# Altium schematic sheet 04_FEATHER-CONNECTION.SchDoc
size A4; CheckedBy: Inženjer 2; CompanyName: Byte Lab Grupa d.o.o.; Engineer: Matija Puskar; Organization: Byte Lab Grupa d.o.o.; Address1: Medarska 69/1, 10000 Zagreb, Croatia; DocumentNumber: 1; SheetNumber: 4; SheetTotal: 7; Web: www.byte-lab.com; ProjectName: P1X-0XX
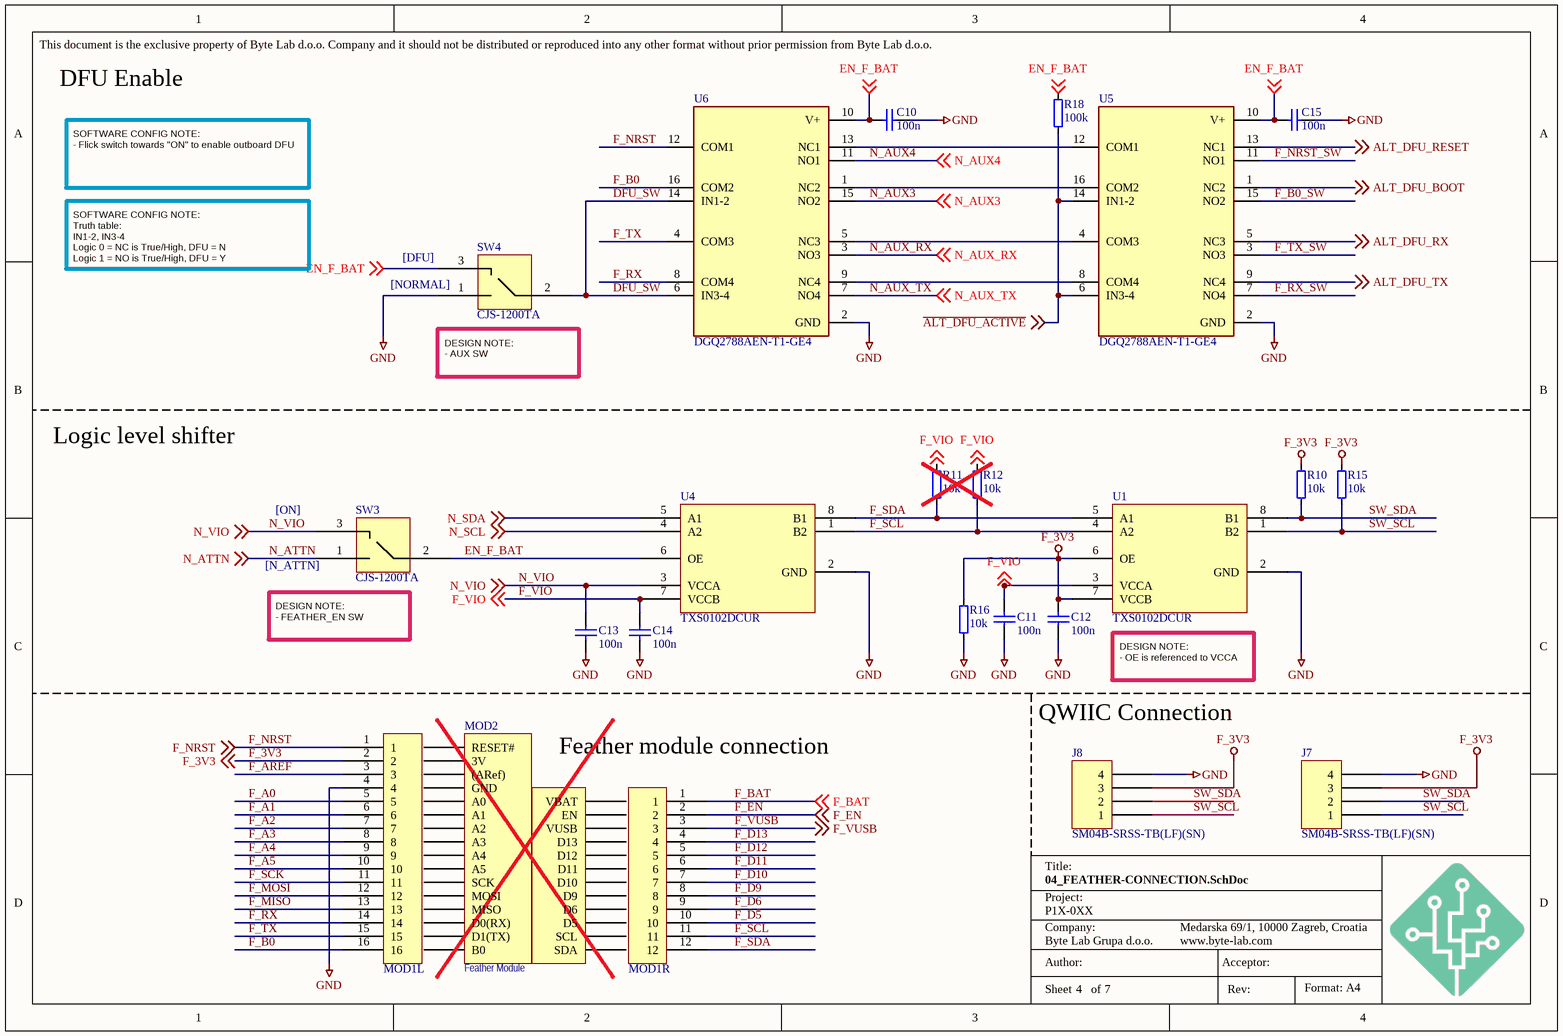
[diagram p0: 04_FEATHER-CONNECTION.SchDoc]

## Parts
C10  100n  [C-0402]
C11  100n  [C-0402]
C12  100n  [C-0402]
C13  100n  [C-0402]
C14  100n  [C-0402]
C15  100n  [C-0402]
J7  SM04B-SRSS-TB(LF)(SN)  [JST SM04B-SRSS-TB]
J8  SM04B-SRSS-TB(LF)(SN)  [JST SM04B-SRSS-TB]
MOD1L  CES-116-01-L-S  [16PIN_254MM]  (value not drawn)
MOD1R  CES-112-01-L-S  [12PIN_254MM]  (value not drawn)
MOD2  Feather Module  [BLUES_WIRELESS_SWAN_2-54_HEADERS]  (no BOM)
R10  10k  [R-0402]
R11  10k  [R-0402]
R12  10k  [R-0402]
R15  10k  [R-0402]
R16  10k  [R-0402]
R18  100k  [R-0402]
SW3  CJS-1200TA  [SW_CJS-1200TA]
SW4  CJS-1200TA  [SW_CJS-1200TA]
U1  TXS0102DCUR  [SOP50P310X90-8N]
U4  TXS0102DCUR  [SOP50P310X90-8N]
U5  DGQ2788AEN-T1-GE4  [QFN40P260X180X60-16N]
U6  DGQ2788AEN-T1-GE4  [QFN40P260X180X60-16N]

## Nets
F_3V3: C12.1 J7.3 J8.3 MOD1L.2 R10.2 R15.2 R16.1 U1.6(OE) U1.7(VCCB) ; off-sheet F_3V3
GND: C10.1 C11.2 C12.2 C13.2 C14.2 C15.1 J7.4 J8.4 MOD1L.4 R16.2 SW4.1 U1.2(GND) U4.2(GND) U5.2(GND) U6.2(GND)
~{ALT_DFU_ACTIVE}: R18.1 U5.6(IN3-4) U5.14(IN1-2) ; off-sheet ~{ALT_DFU_ACTIVE}
ALT_DFU_BOOT: U5.1(NC2) ; off-sheet ALT_DFU_BOOT
ALT_DFU_RESET: U5.13(NC1) ; off-sheet ALT_DFU_RESET
ALT_DFU_RX: U5.5(NC3) ; off-sheet ALT_DFU_RX
ALT_DFU_TX: U5.9(NC4) ; off-sheet ALT_DFU_TX
DFU_SW: SW4.2 U6.6(IN3-4) U6.14(IN1-2)
EN_F_BAT: C10.2 C15.2 R18.2 SW3.2 SW4.3 U4.6(OE) U5.10(V+) U6.10(V+) ; off-sheet EN_F_BAT
F_A0: MOD1L.5
F_A1: MOD1L.6
F_A2: MOD1L.7
F_A3: MOD1L.8
F_A4: MOD1L.9
F_A5: MOD1L.10
F_AREF: MOD1L.3
F_B0: MOD1L.16 U6.16(COM2)
F_B0_SW: U5.15(NO2)
F_BAT: MOD1R.1 ; off-sheet F_BAT
F_D5: MOD1R.10
F_D6: MOD1R.9
F_D9: MOD1R.8
F_D10: MOD1R.7
F_D11: MOD1R.6
F_D12: MOD1R.5
F_D13: MOD1R.4
F_EN: MOD1R.2 ; off-sheet F_EN
F_MISO: MOD1L.13
F_MOSI: MOD1L.12
F_NRST: MOD1L.1 U6.12(COM1) ; off-sheet F_NRST
F_NRST_SW: U5.11(NO1)
F_RX: MOD1L.14 U6.8(COM4)
F_RX_SW: U5.7(NO4)
F_SCK: MOD1L.11
F_SCL: MOD1R.11 R12.1 U1.4(A2) U4.1(B2)
F_SDA: MOD1R.12 R11.1 U1.5(A1) U4.8(B1)
F_TX: MOD1L.15 U6.4(COM3)
F_TX_SW: U5.3(NO3)
F_VIO: C11.1 C14.1 R11.2 R12.2 U1.3(VCCA) U4.7(VCCB) ; off-sheet F_VIO
F_VUSB: MOD1R.3 ; off-sheet F_VUSB
N_ATTN: SW3.1 ; off-sheet N_ATTN
N_AUX3: U6.15(NO2) ; off-sheet N_AUX3
N_AUX4: U6.11(NO1) ; off-sheet N_AUX4
N_AUX_RX: U6.3(NO3) ; off-sheet N_AUX_RX
N_AUX_TX: U6.7(NO4) ; off-sheet N_AUX_TX
N_SCL: U4.4(A2) ; off-sheet N_SCL
N_SDA: U4.5(A1) ; off-sheet N_SDA
N_VIO: C13.1 SW3.3 U4.3(VCCA) ; off-sheet N_VIO
SW_SCL: J7.1 J8.1 R15.1 U1.1(B2)
SW_SDA: J7.2 J8.2 R10.1 U1.8(B1)
NetU5_4: U5.4(COM3) U6.5(NC3)
NetU5_8: U5.8(COM4) U6.9(NC4)
NetU5_12: U5.12(COM1) U6.13(NC1)
NetU5_16: U5.16(COM2) U6.1(NC2)

Not connected (* = marked no-connect by the designer): MOD2 1(RESET#) 2(3V) 3((ARef)) 4(GND) 5(A0) 6(A1) 7(A2) 8(A3) 9(A4) 10(A5) 11(SCK) 12(MOSI) 13(MISO) 14(D0(RX)) 15(D1(TX)) 16(B0) 17(SDA) 18(SCL) 19(D5) 20(D6) 21(D9) 22(D10) 23(D11) 24(D12) 25(D13) 26(VUSB) 27(EN) 28(VBAT)

## Notes on the sheet
- DFU Enable
- SOFTWARE CONFIG NOTE:
  - Flick switch towards "ON" to enable outboard DFU
- SOFTWARE CONFIG NOTE:
  Truth table:
  IN1-2, IN3-4
  Logic 0 = NC is True/High, DFU = N
  Logic 1 = NO is True/High, DFU = Y
- (near SW4) [NORMAL]
- (near SW4) [DFU]
- (near SW4) DESIGN NOTE:
  - AUX SW
- Logic level shifter
- [ON]
- (near SW3) [N_ATTN]
- (near SW3) DESIGN NOTE:
  - FEATHER_EN SW
- DESIGN NOTE:
  - OE is referenced to VCCA
- (near MOD2) Feather module connection
- QWIIC Connection
- This document is the exclusive property of Byte Lab d.o.o. Company and it should not be distributed or reproduced into any other format without prior permission from Byte Lab d.o.o.
- Project:
- Title:
- Author:
- Company:
- Acceptor:
- Format: A4
- Sheet
- of
- Rev:

## Library data of the parts
C10-C15 = C0402-100n-16V-X7R: Capacitor ceramic 100n ±10% X7R 16V 0402; BL Part Number: 2000-908; Drawn_By: Puskar; Checked_By: Dodig; Manufacturer: N/A; Supplier 1: Digi-Key; Supplier Part Number 1: 490-3261-1-ND; Note: *; Manufacturer Part Number: N/A; DateModified: 27-08-2013
J7 J8 = SM04B-SRSS-TB(LF)(SN): CONN HEADER SH 4POS SIDE 1MM TIN; Manufacturer: JST Sales America Inc.; BL Part Number: 2002-058; Drawn_By: Blues Wireless; Supplier 1: Digi-Key; Manufacturer Part Number: SM04B-SRSS-TB(LF)(SN); Supplier Part Number 1: 455-1804-1-ND
MOD1L = SOCKET_LFB_16: Socket 16-Pin, 0.100 in; Manufacturer: Samtec Inc.; BL Part Number: 2007-463; Drawn_By: Blues Wireless; Supplier 1: Digi-Key; Supplier Part Number 1: CES-116-01-L-S-ND; Manufacturer Part Number: CES-116-01-L-S
MOD1R = SOCKET_LFB_12: Socket 12-Pin, 0.100 in; Manufacturer: Samtec Inc.; BL Part Number: 2007-464; Drawn_By: Blues Wireless; Supplier 1: Digi-Key; Supplier Part Number 1: 612-CES-112-01-L-S-ND; Manufacturer Part Number: CES-112-01-L-S
MOD2 = ADAFRUIT_FEATHER_COMMON_1: Typical Adafruit Feather Pinout
R10-R12 R15 R16 = R0402-10k-1: Resistor 10k ±1% 0402; BL Part Number: 2000-729; Checked_By: Dodig; Drawn_By: Puskar; Supplier 1: Digi-Key; Manufacturer: N/A; Manufacturer Part Number: N/A; Supplier Part Number 1: 311-10.0KLRCT-ND; DateModified: 27-08-2013; Note: *
R18 = R0402-100k-1: Resistor 100k ±1% 0402; BL Part Number: 2000-727; Checked_By: Dodig; Drawn_By: Puskar; Supplier 1: Digi-Key; Manufacturer: N/A; Manufacturer Part Number: N/A; Supplier Part Number 1: RHM100CDCT-ND; DateModified: 27-10-2013; Note: *
SW3 SW4 = CJS-1200TA: Switch Slide N.O./N.C. SPDT Raised Slide 0.1A 24VDC J-Hook SMD Embossed T/R; Manufacturer: Nidec Copal; BL Part Number: 2007-456; Drawn_By: Blues Wireless; Supplier 1: Digi-Key; Manufacturer Part Number: CJS-1200TA; Supplier Part Number 1: 563-1021-6-ND
U1 U4 = TXS0102DCUR: 2-Bit Bidirectional Voltage-Level Shifter for Open-Drain and Push-Pull Application 8-VSSOP -40 to 85; Manufacturer: Texas Instruments; BL Part Number: 2007-455; Drawn_By: Blues Wireless; Supplier 1: Digi-Key; Manufacturer Part Number: TXS0102DCUR; Supplier Part Number 1: 296-21931-6-ND
U5 U6 = DGQ2788AEN-T1-GE4: Analog Switch Quad SPDT Automotive 16-Pin Mini-QFN T/R; Manufacturer: Vishay; BL Part Number: 2007-457; Drawn_By: Blues Wireless; Supplier 1: Digi-Key; Manufacturer Part Number: DGQ2788AEN-T1-GE4; Supplier Part Number 1: DGQ2788AEN-T1-GE4CT-ND